# Altium schematic sheet CoproMKII_Coprocessor.SchDoc: Coprocessor MCU
size B; Date: MM/DD/YYYY; Author: John Speasmaker; Organization: ORGANIZATION; Address1: ADDRESS 1; Address2: ADDRESS 2; Address3: ADDRESS 3; Address4: ADDRESS 4; Revision: -; SheetNumber: 2; SheetTotal: 4; ENG_APP_DATE: --/--/--; DSN_APP_DATE: --/--/--; CHK_APP_DATE: --/--/--
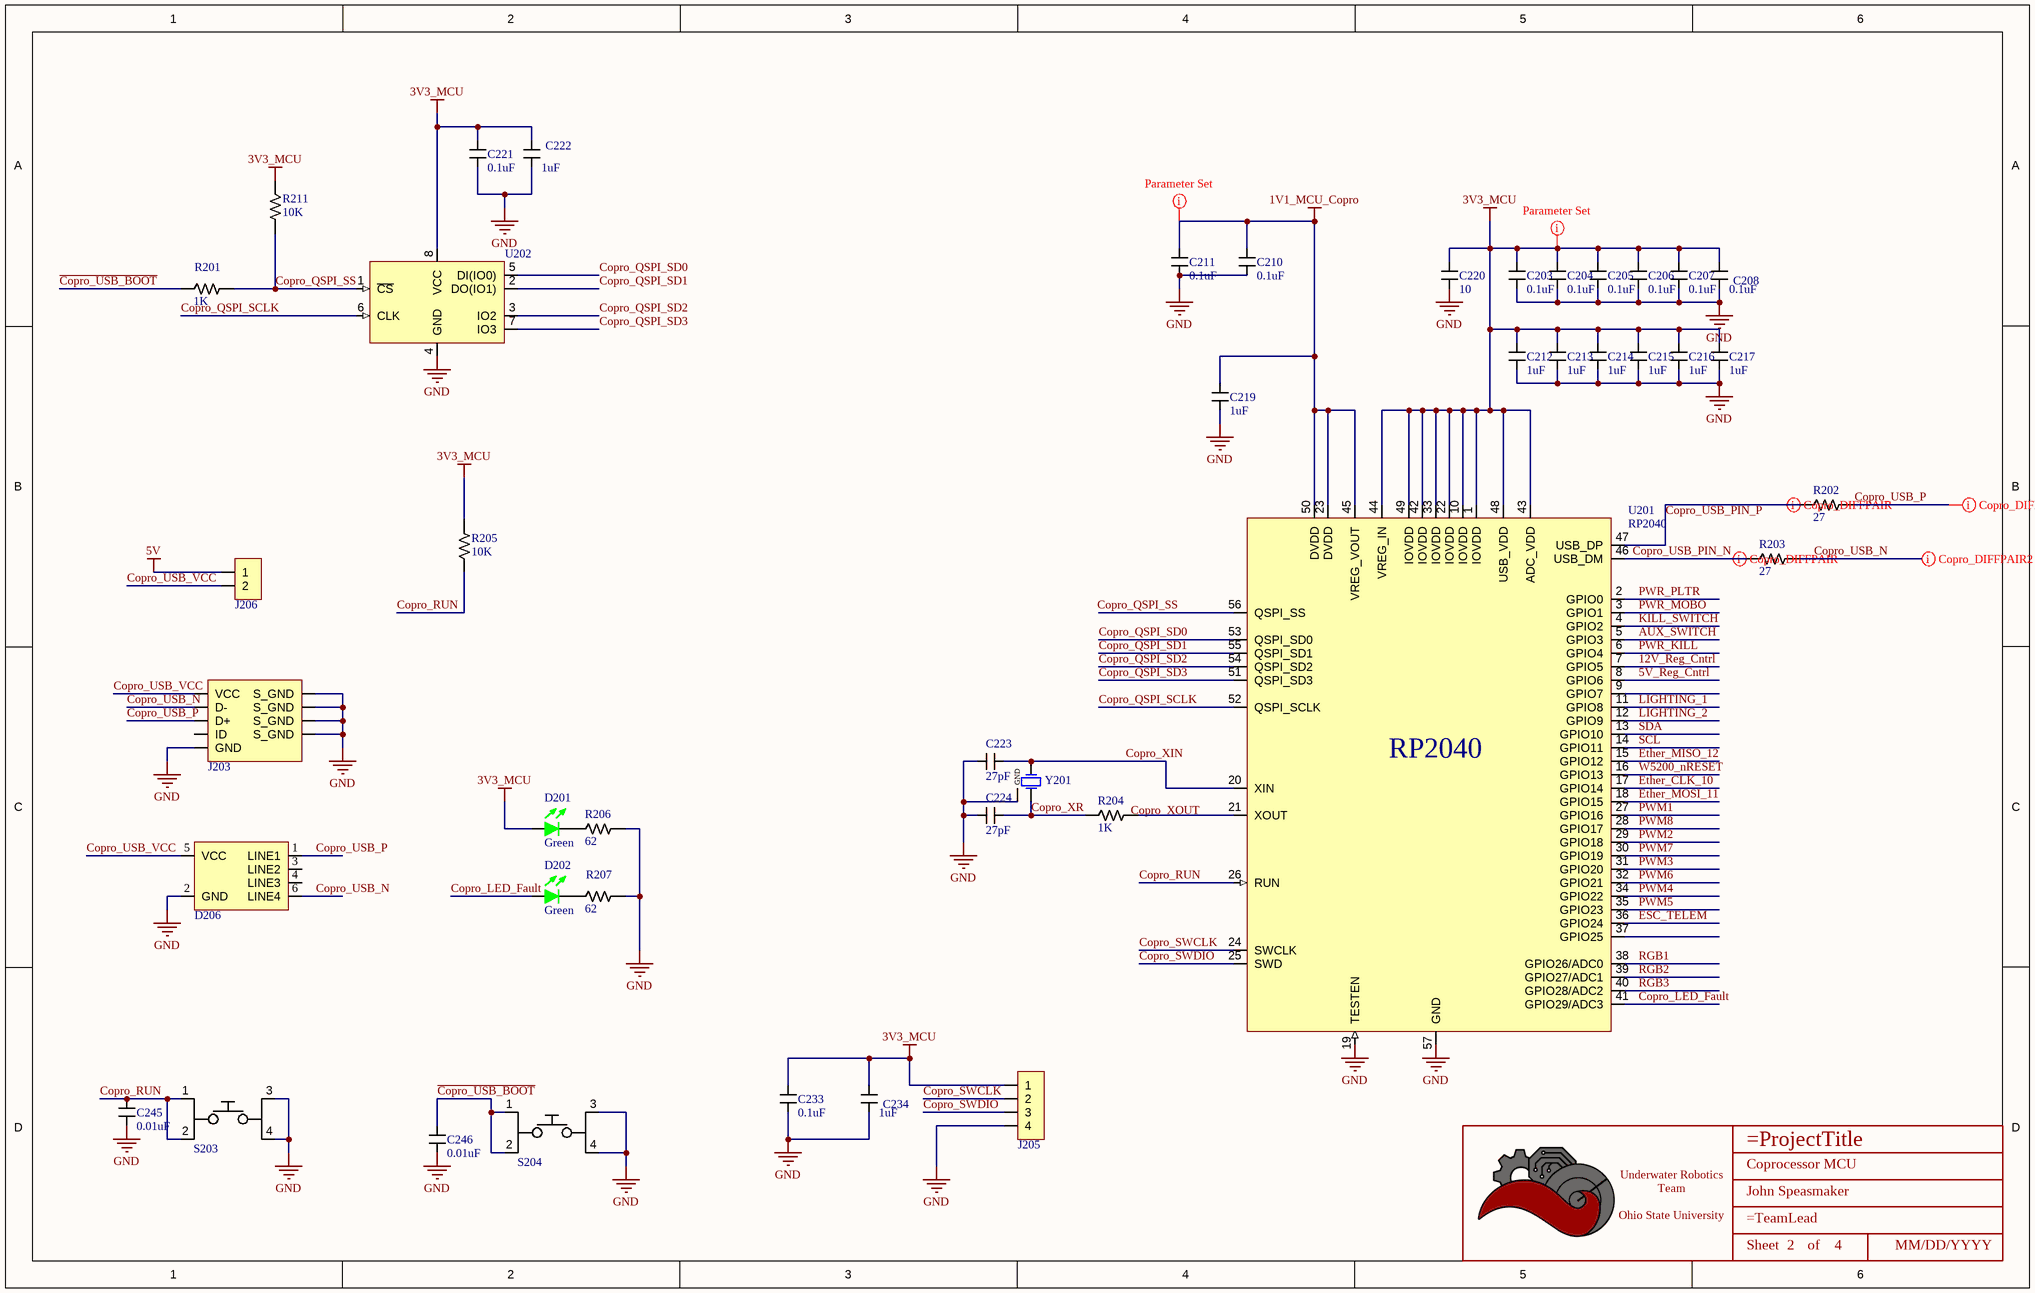
[diagram p0: CoproMKII_Coprocessor.SchDoc]

## Parts
*  Title_Block  [LOGO]  (value not drawn)  (graphical)
C203  value 0.1uF  [CAPACITOR_0603]  (hidden comment: 100nF Ceramic 6.3V)
C204  value 0.1uF  [CAPACITOR_0603]  (hidden comment: 100nF Ceramic 6.3V)
C205  value 0.1uF  [CAPACITOR_0603]  (hidden comment: 100nF Ceramic 6.3V)
C206  value 0.1uF  [CAPACITOR_0603]  (hidden comment: 100nF Ceramic 6.3V)
C207  value 0.1uF  [CAPACITOR_0603]  (hidden comment: 100nF Ceramic 6.3V)
C208  value 0.1uF  [CAPACITOR_0603]  (hidden comment: 100nF Ceramic 6.3V)
C210  value 0.1uF  [CAPACITOR_0603]  (hidden comment: 100nF Ceramic 6.3V)
C211  value 0.1uF  [CAPACITOR_0603]  (hidden comment: 100nF Ceramic 6.3V)
C212  value 1uF  [CAPACITOR_0603]  (hidden comment: 1uF Ceramic 16V)
C213  value 1uF  [CAPACITOR_0603]  (hidden comment: 1uF Ceramic 16V)
C214  value 1uF  [CAPACITOR_0603]  (hidden comment: 1uF Ceramic 16V)
C215  value 1uF  [CAPACITOR_0603]  (hidden comment: 1uF Ceramic 16V)
C216  value 1uF  [CAPACITOR_0603]  (hidden comment: 1uF Ceramic 16V)
C217  value 1uF  [CAPACITOR_0603]  (hidden comment: 1uF Ceramic 16V)
C219  value 1uF  [CAPACITOR_0603]  (hidden comment: 1uF Ceramic 16V)
C220  Value (uF): 10  [CAPACITOR_0603]  (hidden comment: 10uF Ceramic 6.3V)
C221  value 0.1uF  [CAPACITOR_0603]  (hidden comment: 100nF Ceramic 6.3V)
C222  value 1uF  [CAPACITOR_0603]  (hidden comment: 1uF Ceramic 16V)
C223  value 27pF  [CAPACITOR_0603]  (hidden comment: 27pF Ceramic 50V)
C224  value 27pF  [CAPACITOR_0603]  (hidden comment: 27pF Ceramic 50V)
C233  value 0.1uF  [CAPACITOR_0603]  (hidden comment: 100nF Ceramic 6.3V)
C234  value 1uF  [CAPACITOR_0603]  (hidden comment: 1uF Ceramic 16V)
C245  value 0.01uF  [CAPACITOR_0603]  (hidden comment: 10nF Ceramic 6.3V)
C246  value 0.01uF  [CAPACITOR_0603]  (hidden comment: 10nF Ceramic 6.3V)
D201  Color: Green  [LED_0603]  (hidden comment: IN-S63AT5G)
D202  Color: Green  [LED_0603]  (hidden comment: IN-S63AT5G)
D206  TVS DIODE 5VWM 25VC SOT23-6  [SOT 23-6L]  (value not drawn)
J203  USB_MICRO R/A  [CONN_MINIUSB]  (value not drawn)
J205  CONN HEADER VERT 4POS 2.54MM  [HEADER_4PIN_2.54MM]  (value not drawn)
J206  2 POS  [HEADER_2PIN_2.54MM]  (value not drawn)
R201  Value  (Ohms): 1K  [RESISTOR_0603]  (hidden comment: 1k Ohm 5% 1/8W)
R202  Value  (Ohms): 27  [RESISTOR_0603]  (hidden comment: 27 Ohm 5% 1/8W)
R203  Value  (Ohms): 27  [RESISTOR_0603]  (hidden comment: 27 Ohm 5% 1/8W)
R204  Value  (Ohms): 1K  [RESISTOR_0603]  (hidden comment: 1k Ohm 5% 1/8W)
R205  Value  (Ohms): 10K  [RESISTOR_0603]  (hidden comment: 10k Ohm 5% 1/10W)
R206  Value  (Ohms): 62  [RESISTOR_0603]  (hidden comment: 62 Ohm 1% 1/4W)
R207  Value  (Ohms): 62  [RESISTOR_0603]  (hidden comment: 62 Ohm 1% 1/4W)
R211  Value  (Ohms): 10K  [RESISTOR_0603]  (hidden comment: 10k Ohm 5% 1/10W)
S203  SPST Tactile Switch  [TactileSwitch]  (value not drawn)
S204  SPST Tactile Switch  [TactileSwitch]  (value not drawn)
U201  RP2040  [QFN-56 RP2040]
U202  W25Q128JVSIQ  [SOIC-8 W25QxJV]  (value not drawn)
Y201  CRYSTAL 12.0000MHZ 18PF SMD  [4-SMD No Lead Crystal]  (value not drawn)

## Nets
1V1_MCU_Copro: C210.2 C211.2 C219.2 U201.23(DVDD) U201.45(VREG_VOUT) U201.50(DVDD)
3V3_MCU: C203.2 C204.2 C205.2 C206.2 C207.2 C208.2 C212.2 C213.2 C214.2 C215.2 C216.2 C217.2 C220.2 C221.1 C222.1 C233.1 C234.1 D201.1 J205.1 R205.1 R211.2 U201.1(IOVDD) U201.10(IOVDD) U201.22(IOVDD) U201.33(IOVDD) U201.42(IOVDD) U201.43(ADC_VDD) U201.44(VREG_IN) U201.48(USB_VDD) U201.49(IOVDD) U202.8(VCC)
5V: J206.1
GND: C203.1 C204.1 C205.1 C206.1 C207.1 C208.1 C210.1 C211.1 C212.1 C213.1 C214.1 C215.1 C216.1 C217.1 C219.1 C220.1 C221.2 C222.2 C223.2 C224.2 C233.2 C234.2 C245.2 C246.2 D206.2(GND) J203.5(GND) J203.6(S_GND) J203.7(S_GND) J203.8(S_GND) J203.9(S_GND) J205.4 R206.1 R207.1 S203.3 S203.4 S204.3 S204.4 U201.19(TESTEN) U201.57(GND) U202.4(GND) Y201.GND
5V_Reg_Cntrl: U201.8(GPIO6)
12V_Reg_Cntrl: U201.7(GPIO5)
AUX_SWITCH: U201.5(GPIO3)
~{Copro_USB_BOOT}: C246.1 R201.2 S204.1 S204.2
Copro_LED_Fault: D202.1 U201.41(GPIO29/ADC3)
Copro_QSPI_SCLK: U201.52(QSPI_SCLK) U202.6(CLK)
Copro_QSPI_SD0: U201.53(QSPI_SD0) U202.5(DI(IO0))
Copro_QSPI_SD1: U201.55(QSPI_SD1) U202.2(DO(IO1))
Copro_QSPI_SD2: U201.54(QSPI_SD2) U202.3(IO2)
Copro_QSPI_SD3: U201.51(QSPI_SD3) U202.7(IO3)
Copro_QSPI_SS: R201.1 R211.1 U201.56(QSPI_SS) U202.1(~{CS})
Copro_RUN: C245.1 R205.2 S203.1 S203.2 U201.26(RUN)
Copro_SWCLK: J205.2 U201.24(SWCLK)
Copro_SWDIO: J205.3 U201.25(SWD)
Copro_USB_N: D206.6(LINE4) J203.2(D-) R203.1
Copro_USB_P: D206.1(LINE1) J203.3(D+) R202.1
Copro_USB_PIN_N: R203.2 U201.46(USB_DM)
Copro_USB_PIN_P: R202.2 U201.47(USB_DP)
Copro_USB_VCC: D206.5(VCC) J203.1(VCC) J206.2
Copro_XIN: C223.1 U201.20(XIN) Y201.1
Copro_XR: C224.1 R204.2 Y201.2
ESC_TELEM: U201.36(GPIO24)
Ether_CLK_10: U201.17(GPIO14)
Ether_MISO_12: U201.15(GPIO12)
Ether_MOSI_11: U201.18(GPIO15)
KILL_SWITCH: U201.4(GPIO2)
LIGHTING_1: U201.11(GPIO8)
LIGHTING_2: U201.12(GPIO9)
PWM1: U201.27(GPIO16)
PWM2: U201.29(GPIO18)
PWM3: U201.31(GPIO20)
PWM4: U201.34(GPIO22)
PWM5: U201.35(GPIO23)
PWM6: U201.32(GPIO21)
PWM7: U201.30(GPIO19)
PWM8: U201.28(GPIO17)
PWR_KILL: U201.6(GPIO4)
PWR_MOBO: U201.3(GPIO1)
PWR_PLTR: U201.2(GPIO0)
RGB1: U201.38(GPIO26/ADC0)
RGB2: U201.39(GPIO27/ADC1)
RGB3: U201.40(GPIO28/ADC2)
SCL: U201.14(GPIO11)
SDA: U201.13(GPIO10)
W5200_nRESET: U201.16(GPIO13)
NetD201_2: D201.2 R206.2
NetD202_2: D202.2 R207.2
NetR204_1: R204.1 U201.21(XOUT)

Not connected (* = marked no-connect by the designer): D206 3(LINE2) 4(LINE3); J203 4(ID); U201 9(GPIO7) 37(GPIO25)

## Layout directives
rule Supply Nets [Voltage = 3.300]: 3V3_MCU
rule Supply Nets [Voltage = 1.100]: 1V1_MCU_Copro
differential pair; differential pair class USB 2.0: Copro_USB_N, Copro_USB_P, Copro_USB_PIN_N, Copro_USB_PIN_P

## Notes on the sheet
- Labels drawn without touching a wire or pin: Copro_XOUT
- DWG. NO.
- REV.
- SHT.
- THIS DOCUMENT AND THE DATA DISCLOSED HEREIN OR HEREWITH IS THE PROPERTY OF ALTIUM LIMITED AND MAY BE FREELY DISTRIBUTED IN WHOLE. NO RIGHTS ARE RESERVED OR EXPRESS OR IMPLIED WARANTEE GIVEN.
- REVISION
- DESCRIPTION
- DATE
- APPROVED
- ENG:
- APPROVALS
- PROJECT
- DSN:
- CHK:
- REFERENCE DOCUMENTS
- PROJECT REVISION:
- TITLE
- DOCUMENT REVISION:
- DESIGN ITEM:
- BOM:
- FAB DWG:
- PCB DWG:
- ASSY DWG:
- SCALE:
- SIZE
- B
- CAGE CODE
- FILE NAME
- DWG NO.
- SHEET
- OF
- REV
- (in symbol Title_Block) Underwater Robotics Team / Ohio State University; Sheet; of

## Library data of the parts
* = Title_Block: UWRT Schematic Title Block Template / Created June 2021, Dylan Trainor
C203-C208 C210 C211 C221 C233 = CAPACITOR_0.1uF_0603: Cap 100nF 6.3V +/-10% / Ceramic 0603; Made By: Flip B; ComponentLink1Description: Datsheet; ComponentLink1URL: https://www.mouser.com/datasheet/2/212/KEM_C1002_X7R_SMD-1102033.pdf; Tolerance: +/- 10%; Voltage: 6.3V; Supplier 1: Digi-Key; Supplier Part Number 1: 399-15351-1-ND
C212-C217 C219 C222 C234 = CAPACITOR_1uF_0603: Cap 1uF 16V +/-10% / Ceramic 0603; Made By: Flip B; Tolerance: +/- 10%; Voltage: 16V; Supplier 1: Digi-Key; Supplier Part Number 1: 399-7847-1-ND
C220 = CAPACITOR_10uF_0603: Cap 10uF 6.3V +/-20% / Ceramic 0603; Made By: Flip B; ComponentLink1Description: Digikey; ComponentLink1URL: https://www.digikey.com/en/products/detail/samsung-electro-mechanics/CL10A106MQ8NNNC/3886777; Supplier 1: Digi-Key; Supplier Part Number 1: 1276-1119-1-ND; Tolerance: +/- 20%; Voltage: 6.3V
C223 C224 = CAPACITOR_0.000027uF_0603: Cap 27pF 50V +/-5% / Ceramic 0603; Made By: Flip B; ComponentLink1Description: Datsheet; ComponentLink1URL: https://www.mouser.com/datasheet/2/212/KEM_C1002_X7R_SMD-1102033.pdf; Tolerance: +/- 5%; Voltage: 50V; Supplier 1: Digi-Key; Supplier Part Number 1: 311-1063-1-ND
C245 C246 = CAPACITOR_0.01uF_0603: Cap 10nF 6.3V +/-20% / Ceramic 0603; Tolerance: +/- 10%; Made By: Flip B; ComponentLink1Description: Datsheet; ComponentLink1URL: https://www.mouser.com/datasheet/2/212/KEM_C1002_X7R_SMD-1102033.pdf; Voltage: 6.3V; Supplier 1: Mouser; Supplier Part Number 1: 80-C0603C103K9R
D201 D202 = LED_Green_0603_3V: LED Green Vf= 3V If = 0.005A / IN-S63AT5G; Made By: Robert Pafford; Forward Current: 5mA; ComponentLink1Description: Datasheet; ComponentLink1URL: https://www.we-online.de/katalog/datasheet/150060GS75000.pdf; Forward Voltage: 3V; Package: 0603; Supplier 1: Digi-Key; Supplier Part Number 1: 1830-1062-1-ND
D206 = RCLAMP0504S.TCT: 25V Clamp 6A (8/20µs) Ipp Tvs Diode Surface Mount SOT-23-6; Made By: Robert Pafford; Reverse Standoff Voltage (Typ): 5V; Breakdown Voltage (Min): 6V; Supplier 1: Digi-Key; Supplier Part Number 1: RCLAMP0504SCT-ND; Clamping Voltage (Max): 25V
J203 = CONN_MICROUSB: Amphenol Micro USB-B / USB2.0 5 Pin Right Angle SMD; Pitch: 0.65mm; Current Per Pin: 1.8A; Number of Positions: 5; Manufacturer: Amphenol; Configuration: Right Angle; Color: Silver; Created By: Flip B; ComponentLink1Description: Datasheet; ComponentLink1URL: https://cdn.amphenol-icc.com/media/wysiwyg/files/documentation/datasheet/inputoutput/io_usb_micro.pdf?__cf_chl_jschl_tk__=05693735e19256298f6ef6ca2bb2e65c376a4f56-1625503833-0-Abitsb0-ufjOXJYs_S3J3r2iTn-nObalbmXUksF1VvO_h_WEmRdMlUD1I8-hmWSEVWzY1pirKnrPZWfgY3851qyBZe5ZvnNQePLGIzUgdEIQBVUyW36RsbYpDLEWxJ4horD-5gChFgobLYqwmG5aHl0E8lIn_twwPPrOxilK2gP0q9t_CNOs_u5fMqXvXUrlsOv8tIE2NRlu6NVP8qtkL2GjhlkeTUbDMF8WvvpPDTFOgvZ4Y16Ej8F8AhWos88mo5B1HssXozw0XrkJQIqERITUu6rqloz9kf4ZzhBHtDAt-IkiAFY_Ds9SW8FYKKTtINJVpHZQ6Gyu1FFM4Dc9MO0maE8_mmNcwlxqyRoRk_MPWW8VyByXWM5RSp52jteRKw7FeI9WIYvCbPAOy0Eyib-aseIQsnGbglBcUY6_2xp8GYaJM38H3dNvBPsSOfJBPndKedwKHllxjkucXn6xsN0sDXkpGN-cu8_2bDTJ0g-uUucKSCooYX-ApSDNGpkA_p9zv1SOAD8c0zaZVmtiBsN75QpVz2rzq9_BFxOywPvR; Series: 10118192; Supplier 1: Digi-Key; Supplier Part Number 1: 609-4613-1-ND
J205 = HEADER_4PIN_2.54MM: Made By: Robert Pafford; Supplier 1: Digi-Key; Supplier Part Number 1: S1012E-04-ND
J206 = HEADER_2PIN_2.54MM: CONN HEADER VERT 2POS 2.54MM; Configuration: Vertical; Current Per Pin: 1A; Number of Positions: 2; Manufacturer: *; Pitch: 2.54mm; Color: Natural; Created By: Robert P; ComponentLink1Description: Datasheet; ComponentLink1URL: https://www.molex.com/pdm_docs/sd/026013115_sd.pdf; Series: *; Supplier 1: Digi-Key; Supplier Part Number 1: A121480-ND; Supplier 2: Mouser; Supplier Part Number 2: 571-5-146280-2
R201 R204 = RESISTOR_1K_0603: RES 1k OHM 5% 1/8W 0603; Tolerance: +/- 5%; Made By: Robert Pafford; ComponentLink1Description: Datasheet; ComponentLink1URL: https://www.bourns.com/docs/product-datasheets/CRxxxxx.pdf; Wattage: 1/8W; Supplier: Digikey; Digikey Part Numer: CR0603-JW-104ELFTR-ND; Supplier 1: Digi-Key; Supplier Part Number 1: 2019-RK73B1JTTD102JCT-ND
R202 R203 = RESISTOR_27_0603: RES 27 OHM 5% 1/8W 0603; Tolerance: +/- 5%; Made By: Robert Pafford; ComponentLink1Description: Datasheet; ComponentLink1URL: https://www.bourns.com/docs/product-datasheets/CRxxxxx.pdf; Wattage: 1/8W; Supplier: Digikey; Digikey Part Numer: CR0603-JW-104ELFTR-ND; Supplier 1: Digi-Key; Supplier Part Number 1: 2019-RK73B1JTTD270JCT-ND
R205 R211 = RESISTOR_10K_0603: RES 10k OHM 5% 1/10W 0603; Tolerance: +/- 5%; Wattage: 1/8W; Made By: Robert Pafford; ComponentLink1Description: Datasheet; ComponentLink1URL: https://www.bourns.com/docs/product-datasheets/CRxxxxx.pdf; Supplier: Digikey; Digikey Part Numer: CR0603-JW-104ELFTR-ND; Supplier 1: Digi-Key; Supplier Part Number 1: 2019-RK73B1JTTD103JCT-ND
R206 R207 = RESISTOR_62_0603: RES SMD 62 OHM 1% 1/4W 0603; Tolerance: +/- 1%; Made By: Robert Pafford; ComponentLink1Description: Datasheet; ComponentLink1URL: https://www.bourns.com/docs/product-datasheets/CRxxxxx.pdf; Wattage: 1/4W; Supplier: Digikey; Digikey Part Numer: CR0603-JW-104ELFTR-ND; Supplier 1: Digi-Key; Supplier Part Number 1: 541-RCS060362R0FKEACT-ND
S203 S204 = Tactile Switch: SWITCH TACTILE SPST-NO 0.05A 12V; Made By: Robert Pafford; Supplier 1: Digi-Key; Supplier Part Number 1: EG2494-ND
U201 = RP2040: Raspberry Pi RP2040; Made By: Robert Pafford; Input Voltage: 3.3V; Crystal Frequency: 12 MHz; Number of GPIOs: 29; Available Busses: SPI, I2C, PWM, USB; ComponentLink1Description: DigiKey; ComponentLink1URL: *; ComponentLink2Description: Datasheet; ComponentLink2URL: https://datasheets.raspberrypi.org/rp2040/rp2040-datasheet.pdf
U202 = W25Q128JVSIQ: IC FLASH 128MBIT SPI/QUAD 8SOIC; Made By: Robert Pafford; Supplier 1: Digi-Key; Supplier Part Number 1: W25Q128JVSIQ-ND; Size: 128M
Y201 = CRYSTAL_12MHz_SMD: 12 MHz ±20ppm Crystal 18pF 50 Ohms 4-SMD, No Lead; pin to pad: 2>3 GND>2+4; Made By: Siddharth Venkatesan; Frequency: 25 MHz; ESR: 40 Ohms; Load Capacitance: 18pF; Supplier 1: Digi-Key; Supplier Part Number 1: XC2312CT-ND